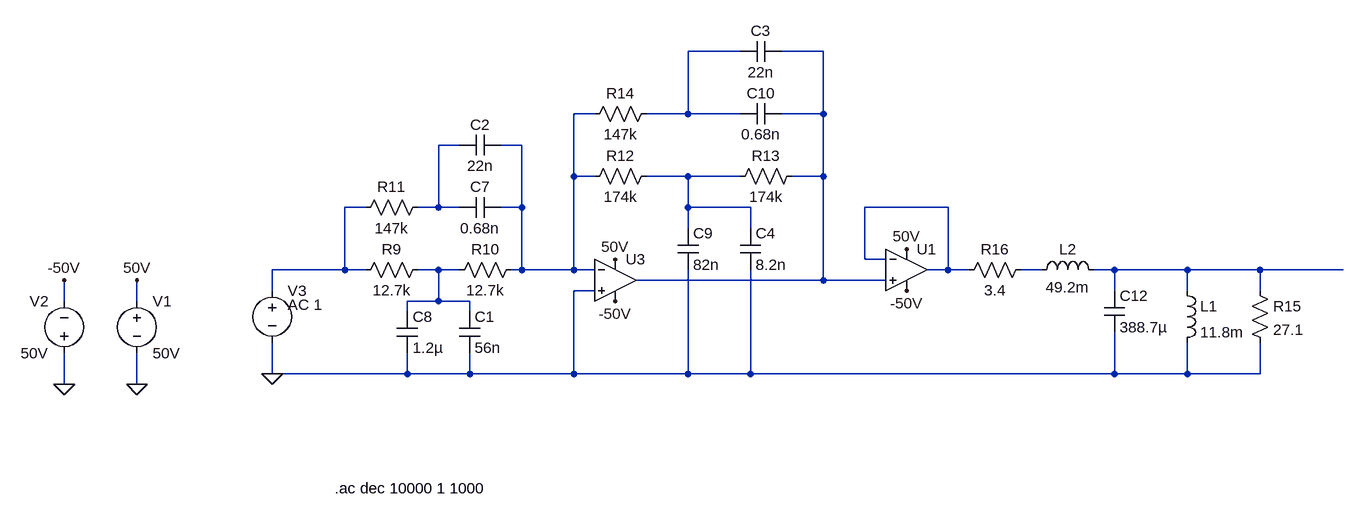
[diagram p0: schematic full_lt_pyle.asc]
full_lt_pyle.asc, the LTspice schematic file:
Version 4
SHEET 1 880 912
WIRE -704 224 -784 224
WIRE -576 224 -640 224
WIRE -928 320 -960 320
WIRE -784 320 -784 224
WIRE -784 320 -848 320
WIRE -704 320 -784 320
WIRE -576 320 -576 224
WIRE -576 320 -640 320
WIRE -1136 368 -1168 368
WIRE -1040 368 -1072 368
WIRE -960 416 -960 320
WIRE -928 416 -960 416
WIRE -784 416 -848 416
WIRE -704 416 -784 416
WIRE -576 416 -576 320
WIRE -576 416 -624 416
WIRE -1280 464 -1312 464
WIRE -1168 464 -1168 368
WIRE -1168 464 -1200 464
WIRE -1136 464 -1168 464
WIRE -1040 464 -1040 368
WIRE -1040 464 -1072 464
WIRE -784 464 -784 416
WIRE -688 464 -784 464
WIRE -384 464 -512 464
WIRE -784 496 -784 464
WIRE -688 496 -688 464
WIRE -512 544 -512 464
WIRE -480 544 -512 544
WIRE -1312 560 -1312 464
WIRE -1312 560 -1424 560
WIRE -1280 560 -1312 560
WIRE -1168 560 -1200 560
WIRE -1136 560 -1168 560
WIRE -1040 560 -1040 464
WIRE -1040 560 -1056 560
WIRE -960 560 -960 416
WIRE -960 560 -1040 560
WIRE -928 560 -960 560
WIRE -384 560 -384 464
WIRE -384 560 -416 560
WIRE -352 560 -384 560
WIRE -240 560 -272 560
WIRE -128 560 -160 560
WIRE -16 560 -128 560
WIRE 96 560 -16 560
WIRE 224 560 96 560
WIRE -576 576 -576 416
WIRE -576 576 -864 576
WIRE -480 576 -576 576
WIRE -1424 592 -1424 560
WIRE -928 592 -960 592
WIRE -128 592 -128 560
WIRE -16 592 -16 560
WIRE 96 592 96 560
WIRE -1744 608 -1744 576
WIRE -1632 608 -1632 576
WIRE -1168 608 -1168 560
WIRE -1168 608 -1216 608
WIRE -1120 608 -1168 608
WIRE -1216 624 -1216 608
WIRE -1120 624 -1120 608
WIRE -1424 720 -1424 672
WIRE -1216 720 -1216 688
WIRE -1216 720 -1424 720
WIRE -1120 720 -1120 688
WIRE -1120 720 -1216 720
WIRE -960 720 -960 592
WIRE -960 720 -1120 720
WIRE -784 720 -784 560
WIRE -784 720 -960 720
WIRE -688 720 -688 560
WIRE -688 720 -784 720
WIRE -128 720 -128 656
WIRE -128 720 -688 720
WIRE -16 720 -16 672
WIRE -16 720 -128 720
WIRE 96 720 96 672
WIRE 96 720 -16 720
WIRE -1744 736 -1744 688
WIRE -1632 736 -1632 688
FLAG -1424 720 0
FLAG -1632 576 50V
FLAG -1744 576 -50V
FLAG -1744 736 0
FLAG -1632 736 0
FLAG -896 544 50V
FLAG -448 528 50V
FLAG -896 608 -50V
FLAG -448 592 -50V
SYMBOL res -1184 544 R90
WINDOW 0 0 56 VBottom 2
WINDOW 3 32 56 VTop 2
SYMATTR InstName R9
SYMATTR Value 12.7k
SYMBOL res -1040 544 R90
WINDOW 0 0 56 VBottom 2
WINDOW 3 32 56 VTop 2
SYMATTR InstName R10
SYMATTR Value 12.7k
SYMBOL res -1184 448 R90
WINDOW 0 0 56 VBottom 2
WINDOW 3 32 56 VTop 2
SYMATTR InstName R11
SYMATTR Value 147k
SYMBOL cap -1072 448 R90
WINDOW 0 0 32 VBottom 2
WINDOW 3 32 32 VTop 2
SYMATTR InstName C7
SYMATTR Value 0.68n
SYMBOL Opamps/UniversalOpamp2 -896 576 R0
SYMATTR InstName U3
SYMBOL cap -1232 624 R0
SYMATTR InstName C8
SYMATTR Value 1.2µ
SYMBOL res -832 400 R90
WINDOW 0 0 56 VBottom 2
WINDOW 3 32 56 VTop 2
SYMATTR InstName R12
SYMATTR Value 174k
SYMBOL cap -800 496 R0
SYMATTR InstName C9
SYMATTR Value 82n
SYMBOL res -608 400 R90
WINDOW 0 0 56 VBottom 2
WINDOW 3 32 56 VTop 2
SYMATTR InstName R13
SYMATTR Value 174k
SYMBOL res -832 304 R90
WINDOW 0 0 56 VBottom 2
WINDOW 3 32 56 VTop 2
SYMATTR InstName R14
SYMATTR Value 147k
SYMBOL cap -640 304 R90
WINDOW 0 0 32 VBottom 2
WINDOW 3 32 32 VTop 2
SYMATTR InstName C10
SYMATTR Value 0.68n
SYMBOL cap -144 592 R0
SYMATTR InstName C12
SYMATTR Value 388.7µ
SYMBOL ind -32 576 R0
SYMATTR InstName L1
SYMATTR Value 11.8m
SYMBOL res 80 576 R0
SYMATTR InstName R15
SYMATTR Value 27.1
SYMBOL res -256 544 R90
WINDOW 0 0 56 VBottom 2
WINDOW 3 32 56 VTop 2
SYMATTR InstName R16
SYMATTR Value 3.4
SYMBOL voltage -1424 576 R0
WINDOW 123 24 38 Left 2
WINDOW 39 0 0 Left 0
SYMATTR Value2 AC 1
SYMATTR InstName V3
SYMATTR Value ""
SYMBOL Opamps/UniversalOpamp2 -448 560 R0
SYMATTR InstName U1
SYMBOL voltage -1632 592 R0
SYMATTR InstName V1
SYMATTR Value 50V
SYMBOL voltage -1744 704 R180
WINDOW 0 24 96 Left 2
WINDOW 3 24 16 Left 2
SYMATTR InstName V2
SYMATTR Value 50V
SYMBOL cap -1136 624 R0
SYMATTR InstName C1
SYMATTR Value 56n
SYMBOL cap -1072 352 R90
WINDOW 0 0 32 VBottom 2
WINDOW 3 32 32 VTop 2
SYMATTR InstName C2
SYMATTR Value 22n
SYMBOL cap -640 208 R90
WINDOW 0 0 32 VBottom 2
WINDOW 3 32 32 VTop 2
SYMATTR InstName C3
SYMATTR Value 22n
SYMBOL cap -704 496 R0
SYMATTR InstName C4
SYMATTR Value 8.2n
SYMBOL ind -256 576 R270
WINDOW 0 32 56 VTop 2
WINDOW 3 5 56 VBottom 2
SYMATTR InstName L2
SYMATTR Value 49.2m
TEXT -1328 896 Left 2 !.ac dec 10000 1 1000

The netlist it stands for:
* full_lt_pyle.asc
R9 N008 N006 12.7k
R10 N003 N008 12.7k
R11 N004 N006 147k
C7 N003 N004 0.68n
XU3 0 N003 50V -50V N002 level.2 Avol=1Meg GBW=10Meg Slew=10Meg ilimit=25m rail=0 Vos=0 phimargin=45 en=0 enk=0 in=0 ink=0 Rin=500Meg  ; pins IN+ IN- V+ V- OUT
C8 N008 0 1.2µ
R12 N005 N003 174k
C9 N005 0 82n
R13 N002 N005 174k
R14 N001 N003 147k
C10 N002 N001 0.68n
C12 N010 0 388.7µ
L1 N010 0 11.8m
R15 N010 0 27.1
R16 N009 N007 3.4
V3 N006 0 AC 1
XU1 N002 N007 50V -50V N007 level.2 Avol=1Meg GBW=10Meg Slew=10Meg ilimit=25m rail=0 Vos=0 phimargin=45 en=0 enk=0 in=0 ink=0 Rin=500Meg  ; pins IN+ IN- V+ V- OUT
V1 50V 0 50V
V2 0 -50V 50V
C1 N008 0 56n
C2 N003 N004 22n
C3 N002 N001 22n
C4 N005 0 8.2n
L2 N009 N010 49.2m
.ac dec 10000 1 1000
.lib UniversalOpamps2.sub
.backanno
.end